# EAGLE design tubeboard (EAGLE 7.2.0)
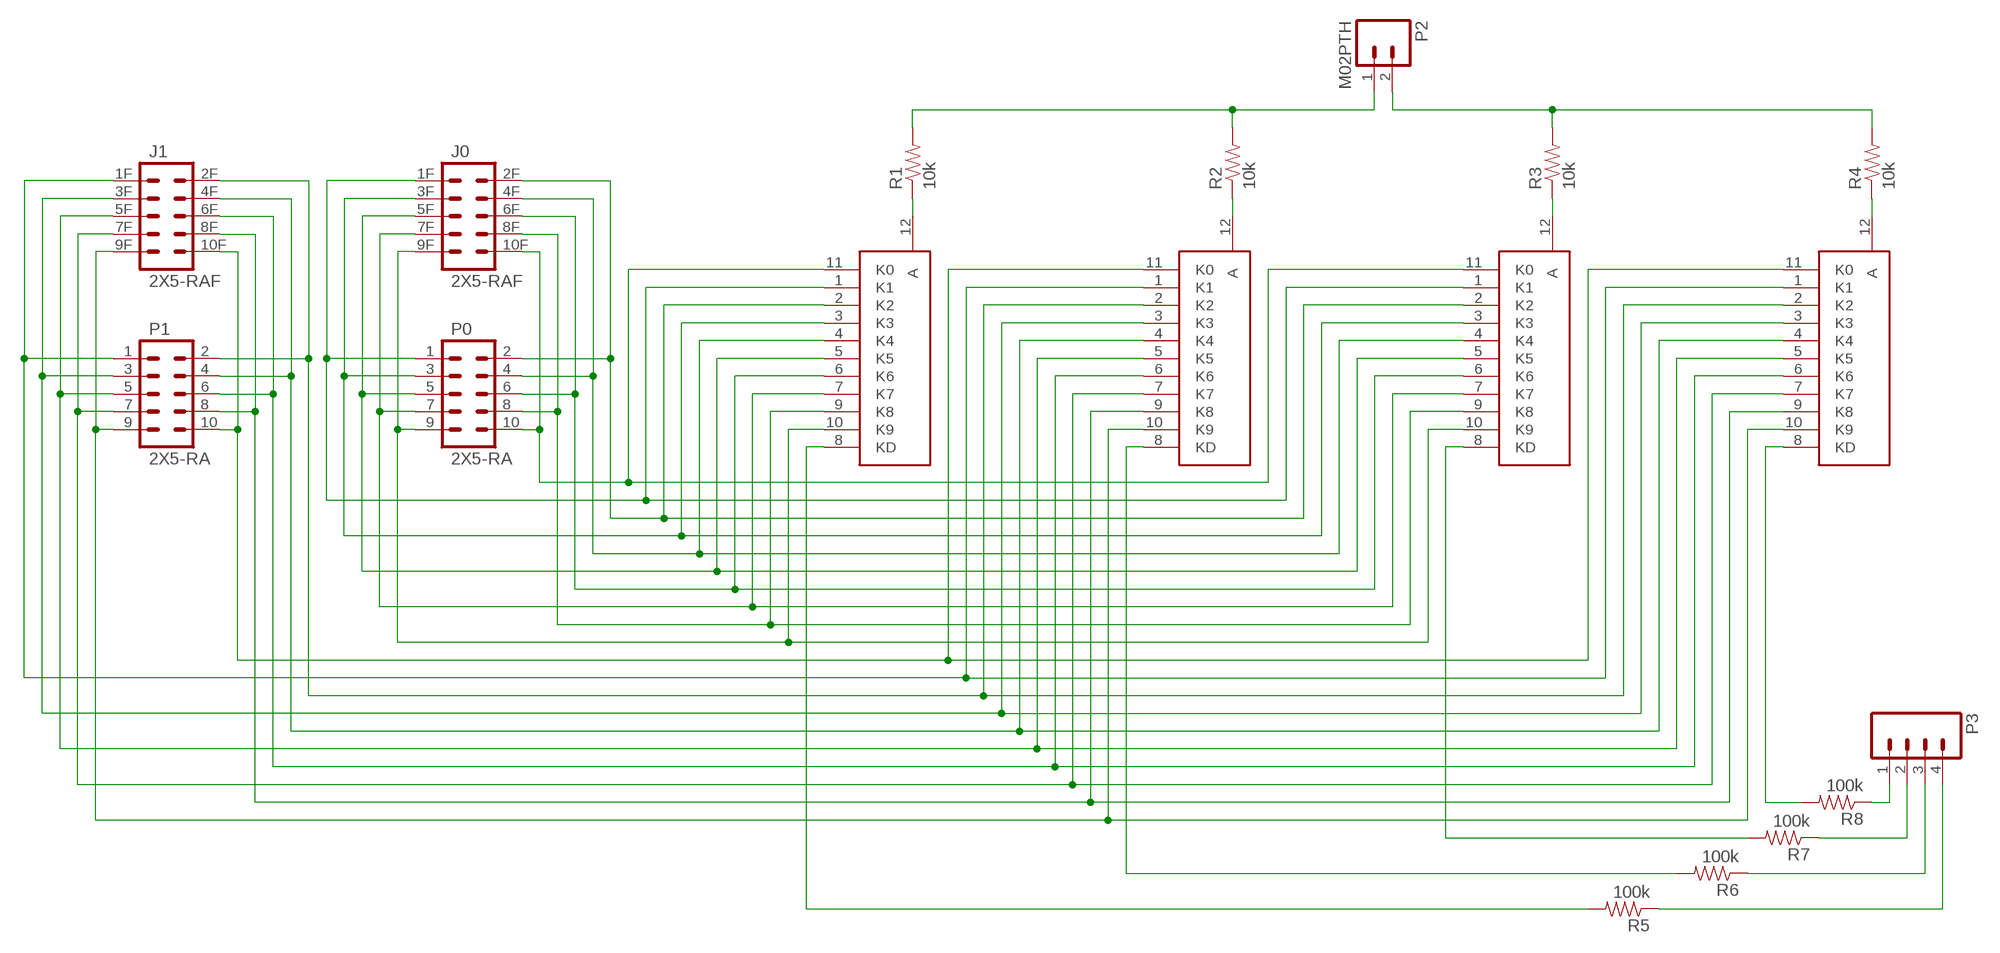
[diagram p0: schematic, sheet 1]

## Parts
J0  2X5-RAF  [2X5-RAF]
J1  2X5-RAF  [2X5-RAF]
P0  2X5-RA  [2X5-RA]
P1  2X5-RA  [2X5-RA]
P2  M02PTH  [1X02]
P3  M04PTH  [1X04]
R1  10k  RESISTORPTH-1/2W  [AXIAL-0.5]
R2  10k  RESISTORPTH-1/2W  [AXIAL-0.5]
R3  10k  RESISTORPTH-1/2W  [AXIAL-0.5]
R4  10k  RESISTORPTH-1/2W  [AXIAL-0.5]
R5  100k  RESISTORPTH-1/2W  [AXIAL-0.5]
R6  100k  RESISTORPTH-1/2W  [AXIAL-0.5]
R7  100k  RESISTORPTH-1/2W  [AXIAL-0.5]
R8  100k  RESISTORPTH-1/2W  [AXIAL-0.5]
V0  IN-8-2-GRID  [IN-8-2-GRID]
V1  IN-8-2-GRID  [IN-8-2-GRID]
V2  IN-8-2-GRID  [IN-8-2-GRID]
V3  IN-8-2-GRID  [IN-8-2-GRID]

## Nets
N$1: P2.1 R1.P$2 R2.P$2
N$2: P3.1 R8.P$1
N$3: P3.2 R7.P$1
N$4: P3.3 R6.P$1
N$5: P3.4 R5.P$1
N$6: J0.10F P0.10 V0.11(K0) V2.11(K0)
N$7: J0.9F P0.9 V0.10(K9) V2.10(K9)
N$8: J0.7F P0.7 V0.7(K7) V2.7(K7)
N$9: J0.5F P0.5 V0.5(K5) V2.5(K5)
N$10: J0.3F P0.3 V0.3(K3) V2.3(K3)
N$11: R1.P$1 V0.12(A)
N$12: R2.P$1 V1.12(A)
N$13: R3.P$1 V2.12(A)
N$14: R4.P$1 V3.12(A)
N$15: R5.P$2 V0.8(KD)
N$16: R6.P$2 V1.8(KD)
N$17: R7.P$2 V2.8(KD)
N$18: R8.P$2 V3.8(KD)
N$19: J0.1F P0.1 V0.1(K1) V2.1(K1)
N$20: J0.4F P0.4 V0.4(K4) V2.4(K4)
N$21: J1.10F P1.10 V1.11(K0) V3.11(K0)
N$22: J1.9F P1.9 V1.10(K9) V3.10(K9)
N$23: J1.1F P1.1 V1.1(K1) V3.1(K1)
N$24: J1.2F P1.2 V1.2(K2) V3.2(K2)
N$25: J1.3F P1.3 V1.3(K3) V3.3(K3)
N$26: J1.4F P1.4 V1.4(K4) V3.4(K4)
N$27: J1.5F P1.5 V1.5(K5) V3.5(K5)
N$28: J1.7F P1.7 V1.7(K7) V3.7(K7)
N$29: J0.6F P0.6 V0.6(K6) V2.6(K6)
N$30: J1.8F P1.8 V1.9(K8) V3.9(K8)
N$31: J1.6F P1.6 V1.6(K6) V3.6(K6)
N$32: P2.2 R3.P$2 R4.P$2
N$33: J0.2F P0.2 V0.2(K2) V2.2(K2)
N$39: J0.8F P0.8 V0.9(K8) V2.9(K8)

## Library data of the parts
J0 J1 = bodger:2X5-RAF
P0 P1 = bodger:2X5-RA
P2 = SparkFun-Connectors:M02: Standard 2-pin 0.1" header. Use with - straight break away headers ( PRT-00116) - right angle break away headers (PRT-00553) - swiss pins (PRT-00743) - machine pins (PRT-00117) - female headers (PRT-00115) Molex polarized connector foot print use with: PRT-08233 with associated crimp pins and housings. 2.54_SCREWTERM for use with PRT-10571. 3.5mm Screw Terminal footprints for PRT-08084 5mm Screw Terminal footprints for use with PRT-08433
P3 = SparkFun-Connectors:M04: Header 4 Standard 4-pin 0.1" header. Use with straight break away headers (SKU : PRT-00116), right angle break away headers (PRT-00553), swiss pins (PRT-00743), machine pins (PRT-00117), and female headers (PRT-00115). Molex polarized connector foot print use with SKU : PRT-08231 with associated crimp pins and housings. 1MM SMD Version SKU: PRT-10208
R1-R8 = SparkFun-Passives:RESISTOR: Resistor Basic schematic elements and footprints for 0603, 1206, and PTH resistors.
V0 V1-V3 = bodger:IN-8-2-GRID

## Board
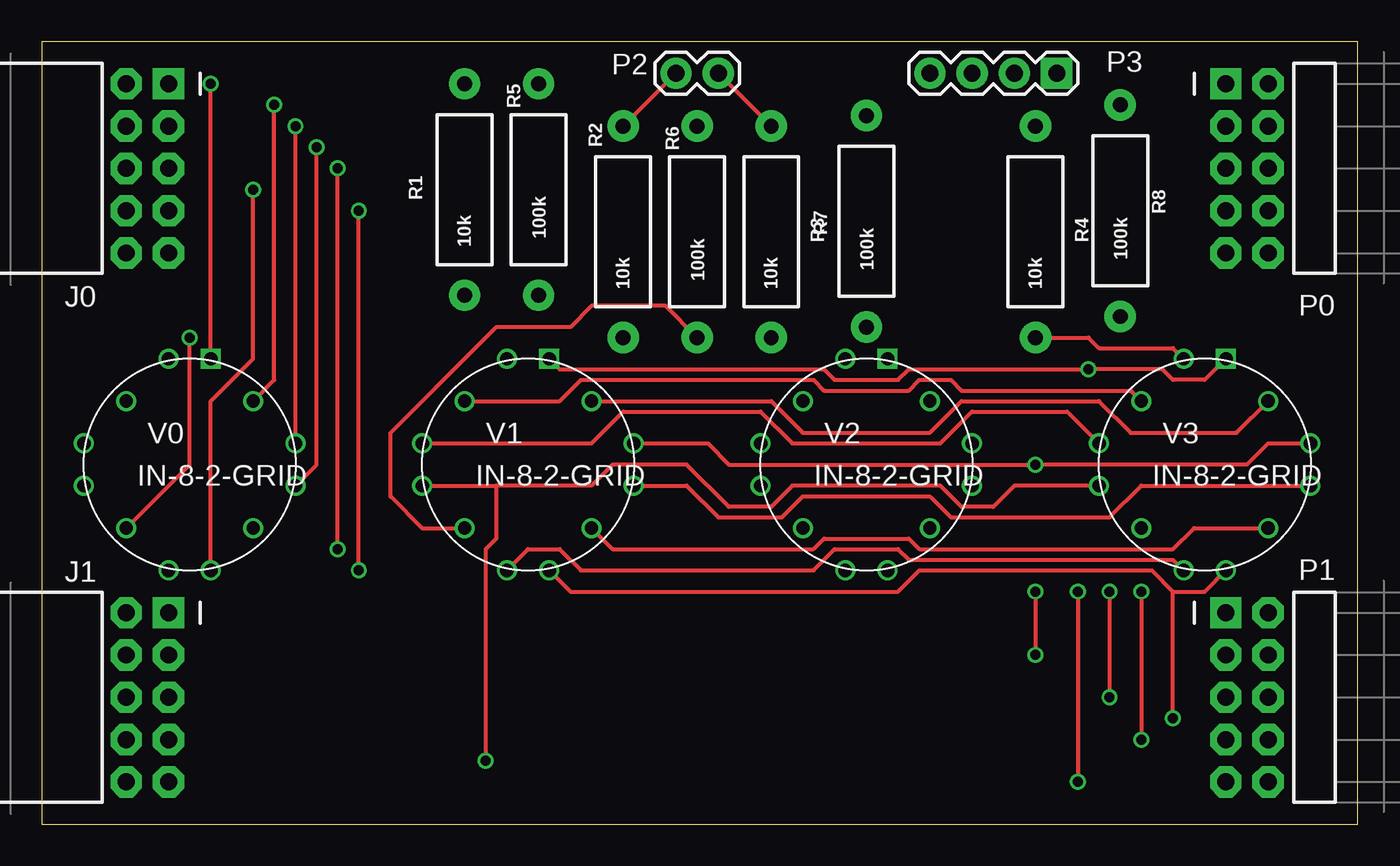
[diagram p1: board, top side]
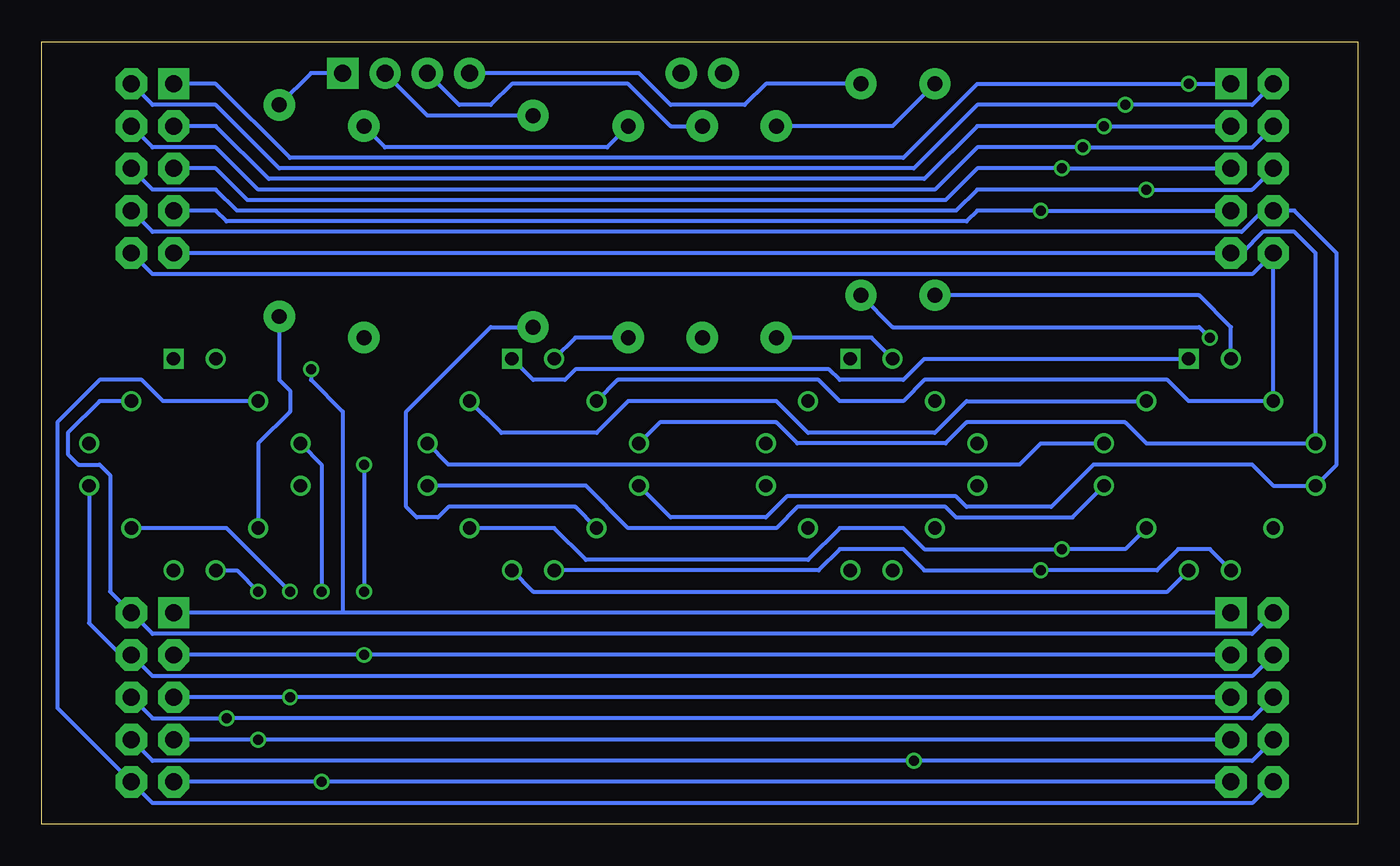
[diagram p2: board, bottom side, seen from below]

Size 79.05 x 46.98 mm. Coordinates in mm from the lower left corner, seen from the top.
Outline: 0,0 79.05,0 79.05,46.98 0,46.98 0,0
Copper layers (1*16): Top 0.0356mm / dielectric 1.5011mm / Bottom 0.0356mm
Design rules "LaenPCBOrder": minimum track width 6mil, minimum drill 13mil, track to track 6mil, track to pad 6mil, pad to pad 6mil, via to via 6mil, smd to smd 6mil, copper to edge 15mil, drill to drill 6mil, minimum pad ring 7mil, minimum via ring 7mil, stop-mask expansion 3mil, vias tented up to drill 0mil, thermal gap 10mil

### Footprints (pad centres in the part's own frame; a part is rotated, then mirrored left to right if it is on the bottom)
2X5-RAF = drill 1.016 pad 1.88 square: 1F -1.27,-5.08 | drill 1.016 pad 1.88 octagon: 2F 1.27,-5.08; 3F -1.27,-2.54; 4F 1.27,-2.54; 5F -1.27,0; 6F 1.27,0; 7F -1.27,2.54; 8F 1.27,2.54; 9F -1.27,5.08; 10F 1.27,5.08
2X5-RA = drill 1.016 pad 1.88 square: 1 -1.27,5.08 | drill 1.016 pad 1.88 octagon: 2 1.27,5.08; 3 -1.27,2.54; 4 1.27,2.54; 5 -1.27,0; 6 1.27,0; 7 -1.27,-2.54; 8 1.27,-2.54; 9 -1.27,-5.08; 10 1.27,-5.08
1X02 = drill 1.016 pad 1.88: 1 0,0; 2 2.54,0
1X04 = drill 1.016 pad 1.88 square: 1 0,0 | drill 1.016 pad 1.88: 2 2.54,0; 3 5.08,0; 4 7.62,0
AXIAL-0.5 = drill 0.9 pad 1.88: P$1 -6.35,0; P$2 6.35,0
IN-8-2-GRID = drill 0.8 square: 1 1.27,6.35 | drill 0.8: 2 3.81,3.81; 3 6.35,1.27; 4 6.35,-1.27; 5 3.81,-3.81; 6 1.27,-6.35; 7 -1.27,-6.35; 8 -3.81,-3.81; 9 -6.35,-1.27; 10 -6.35,1.27; 11 -3.81,3.81; 12 -1.27,6.35

### Placement (x,y rotation side)
J0  6.35,39.37 180 top
J1  6.35,7.62 180 top
P0  72.39,39.37 0 top
P1  72.39,7.62 0 top
P2  38.1,45.09 0 top
P3  60.96,45.09 180 top
R1  25.4,38.1 90 top
R2  34.92,35.56 90 top
R3  43.81,35.56 90 top
R4  59.69,35.56 90 top
R5  29.84,38.1 270 top
R6  39.37,35.56 270 top
R7  49.53,36.2 270 top
R8  64.77,36.83 270 top
V0  8.89,21.59 0 top
V1  29.21,21.59 0 top
V2  49.53,21.59 0 top
V3  69.85,21.59 0 top

### Tracks (layer width: path | path; a pad name or v marks a point on that pad's centre or on a via)
N$1
  Top 0.254: P2.1 R2.P$2
  Bottom 0.254: R1.P$2 27.94,41.91 R2.P$2
N$2
  Bottom 0.254: P3.1 62.87,45.09 R8.P$1
N$3
  Bottom 0.254: R7.P$1 55.88,42.55 P3.2
N$4
  Bottom 0.254: R6.P$1 41.27,41.91 43.81,44.45 50.8,44.45 52.07,43.18 53.98,43.18 P3.3
N$5
  Bottom 0.254: R5.P$1 35.56,44.45 36.83,43.18 41.27,43.18 43.18,45.09 P3.4
N$6
  Bottom 0.254: V2.11 44.45,26.67 32.38,26.67 31.11,25.4 27.3,25.4 26.04,26.67 11.43,26.67 10.16,25.4 V0.11 J0.10F 6.35,33.02 72.39,33.02 P0.10
N$7
  Bottom 0.254: P0.9 J0.9F 6.99,34.29 5.71,35.56 3.81,35.56 2.54,34.29 V0.10 12.7,22.86 13.97,24.13 23.5,24.13 24.77,22.86 33.66,22.86 34.92,24.13 41.91,24.13 V2.10
N$8  (via drill 0.6)
  Top 0.254: v19.05,15.24 v19.05,36.83
  Bottom 0.254: P0.7 68.58,36.83 67.94,36.2 23.5,36.2 22.86,36.83 v19.05,36.83 J0.7F | V0.7 8.89,16.51 10.79,16.51 12.06,15.24 v19.05,15.24 26.04,15.24 27.3,16.51 31.11,16.51 32.38,15.24 V2.7
N$9  (via drill 0.6)
  Top 0.254: v17.78,16.51 v17.78,39.37
  Bottom 0.254: P0.5 68.58,39.37 66.67,37.47 24.77,37.47 22.86,39.37 v17.78,39.37 J0.5F | V0.5 13.97,16.51 v17.78,16.51 26.04,16.51 27.3,17.78 31.11,17.78 33.02,15.88 46.35,15.88 48.26,17.78 V2.5
N$10  (via drill 0.6)
  Top 0.254: V0.3 v15.24,41.91
  Bottom 0.254: P0.3 68.58,41.91 65.41,38.73 26.04,38.73 22.86,41.91 v15.24,41.91 J0.3F | V2.3 54.61,21.59 20.32,21.59 19.05,22.86 V0.3
N$11
  Bottom 0.254: V0.12 7.62,29.84 9.53,31.75 R1.P$1
N$12
  Bottom 0.254: V1.12 29.21,29.21 R2.P$1
N$13
  Bottom 0.254: R3.P$1 46.99,29.21 V2.12
N$14
  Top 0.254: R4.P$1 62.87,29.21 63.5,28.57 67.94,28.57 V3.12
N$15  (via drill 0.6)
  Top 0.254: V0.8 8.89,21.59 v8.89,29.21
  Bottom 0.254: R5.P$2 27.94,29.84 9.53,29.84 v8.89,29.21
N$16
  Top 0.254: R6.P$2 37.47,31.11 33.02,31.11 31.75,29.84 27.3,29.84 20.95,23.5 20.95,19.68 22.86,17.78 V1.8
N$17
  Bottom 0.254: V2.8 46.99,19.05 54.61,19.05 55.24,18.41 56.52,18.41 57.15,19.05 57.15,24.77 52.07,29.84 R7.P$2
N$18
  Bottom 0.254: R8.P$2 64.77,26.67 64.14,26.04 64.14,24.77 66.04,22.86 V3.8
N$19  (via drill 0.6)
  Top 0.254: V0.1 v10.16,44.45
  Bottom 0.254: P0.1 68.58,44.45 64.14,40.01 27.3,40.01 22.86,44.45 v10.16,44.45 J0.1F | V2.1 49.53,26.67 47.62,26.67 46.99,27.3 31.75,27.3 31.11,26.67 27.3,26.67 26.04,27.94 V0.1
N$20  (via drill 0.6)
  Top 0.254: V0.4 16.51,21.59 v16.51,40.64
  Bottom 0.254: J0.4F 6.35,40.64 v16.51,40.64 22.86,40.64 25.4,38.1 66.04,38.1 68.58,40.64 72.39,40.64 P0.4 | V2.4 46.35,20.32 43.81,17.78 34.92,17.78 33.66,19.05 24.77,19.05 24.13,18.41 17.14,18.41 V0.4
N$21
  Top 0.254: V1.11 31.11,25.4 32.38,26.67 46.35,26.67 46.99,26.04 52.07,26.04 52.7,26.67 54.61,26.67 55.24,26.04 65.41,26.04 V3.11
  Bottom 0.254: J1.10F 6.35,1.27 72.39,1.27 P1.10 78.11,6.99 78.11,24.13 75.56,26.67 73.03,26.67 71.75,25.4 V3.11
N$22  (via drill 0.6)
  Top 0.254: V1.10 33.02,22.86 34.92,24.77 43.18,24.77 45.09,22.86 53.98,22.86 55.88,24.77 61.59,24.77 V3.10 | v62.23,13.97 v62.23,2.54
  Bottom 0.254: V3.10 62.23,21.59 v62.23,13.97 | J1.9F v62.23,2.54 P1.9
N$23  (via drill 0.6)
  Top 0.254: V1.1 31.11,27.3 46.99,27.3 47.62,26.67 51.44,26.67 52.07,27.3 v62.87,27.3 67.31,27.3 67.94,26.67 69.85,26.67 V3.1
  Bottom 0.254: v62.87,27.3 62.87,26.67 60.96,24.77 60.96,12.7 | J1.1F 60.96,12.7 | 60.96,12.7 P1.1
N$24
  Top 0.254: V1.2 43.81,25.4 45.72,23.5 53.34,23.5 55.24,25.4 63.5,25.4 65.41,23.5 71.75,23.5 V3.2
  Bottom 0.254: J1.2F 6.35,11.43 72.39,11.43 P1.2 74.93,13.97 74.93,20.95 75.56,21.59 76.83,21.59 77.47,22.23 77.47,23.5 75.56,25.4 V3.2
N$25  (via drill 0.6)
  Top 0.254: V1.3 40.01,22.86 41.27,21.59 v59.69,21.59 72.39,21.59 73.66,22.86 V3.3 | v59.69,13.97 v59.69,10.16
  Bottom 0.254: J1.3F v59.69,10.16 P1.3 | v59.69,21.59 v59.69,13.97
N$26
  Top 0.254: V1.4 38.73,20.32 40.64,18.41 44.45,18.41 45.72,19.68 53.34,19.68 54.61,18.41 64.14,18.41 66.04,20.32 V3.4
  Bottom 0.254: J1.4F 6.35,8.89 72.39,8.89 P1.4 74.3,10.16 76.2,12.06 V3.4
N$27  (via drill 0.6)
  Top 0.254: V1.5 34.29,16.51 46.35,16.51 46.99,17.14 52.07,17.14 52.7,16.51 67.94,16.51 69.22,17.78 V3.5 | v64.14,13.97 v64.14,7.62
  Bottom 0.254: J1.5F v64.14,7.62 P1.5 | v64.14,13.97 67.94,17.78 V3.5
N$28  (via drill 0.6)
  Top 0.254: V1.7 29.21,16.51 31.11,16.51 32.38,15.24 46.35,15.24 47.62,16.51 51.44,16.51 52.07,15.88 67.94,15.88 V3.7 | v66.04,13.97 v66.04,5.08
  Bottom 0.254: J1.7F v66.04,5.08 P1.7 | V3.7 67.31,15.24 v66.04,13.97
N$29  (via drill 0.6)
  Top 0.254: V0.6 10.16,25.4 12.7,27.94 v12.7,38.1
  Bottom 0.254: J0.6F 6.35,38.1 v12.7,38.1 22.86,38.1 24.13,36.83 67.31,36.83 68.58,38.1 72.39,38.1 P0.6 | V2.6 49.53,13.97 11.43,13.97 V0.6
N$30  (via drill 0.6)
  Top 0.254: V1.9 27.3,20.32 | V3.9 58.42,20.32 57.15,19.05 55.24,19.05 53.98,20.32 45.09,20.32 43.81,19.05 41.27,19.05 38.73,21.59 34.29,21.59 33.02,20.32 27.3,20.32 | 27.3,20.32 27.3,17.14 26.67,16.51 v26.67,3.81
  Bottom 0.254: J1.8F 6.35,3.81 v26.67,3.81 72.39,3.81 P1.8
N$31  (via drill 0.6)
  Top 0.254: V1.6 31.75,13.97 51.44,13.97 52.7,15.24 66.67,15.24 67.94,13.97 | V3.6 69.85,13.97 67.94,13.97 | v67.94,6.35 67.94,13.97
  Bottom 0.254: J1.6F 6.35,6.35 v67.94,6.35 72.39,6.35 P1.6
N$32
  Top 0.254: P2.2 R3.P$2
  Bottom 0.254: R3.P$2 45.09,40.64 58.42,40.64 R4.P$2
N$33  (via drill 0.6)
  Top 0.254: V0.2 13.97,26.67 v13.97,43.18
  Bottom 0.254: V2.2 51.44,23.5 45.72,23.5 43.81,25.4 34.92,25.4 33.02,23.5 25.4,23.5 23.5,25.4 V0.2 | J0.2F 6.35,43.18 v13.97,43.18 22.86,43.18 26.67,39.37 64.77,39.37 68.58,43.18 72.39,43.18 P0.2
N$39
  Bottom 0.254: P0.8 72.39,35.56 6.99,35.56 5.71,36.83 J0.8F 3.81,36.83 1.27,34.29 1.27,21.59 V0.9 5.08,20.32 6.35,21.59 15.88,21.59 18.41,19.05 23.5,19.05 24.13,19.68 34.29,19.68 35.56,18.41 41.27,18.41 V2.9